# EAGLE design mems_quart_board_exp_4_small (EAGLE 7.6.0)
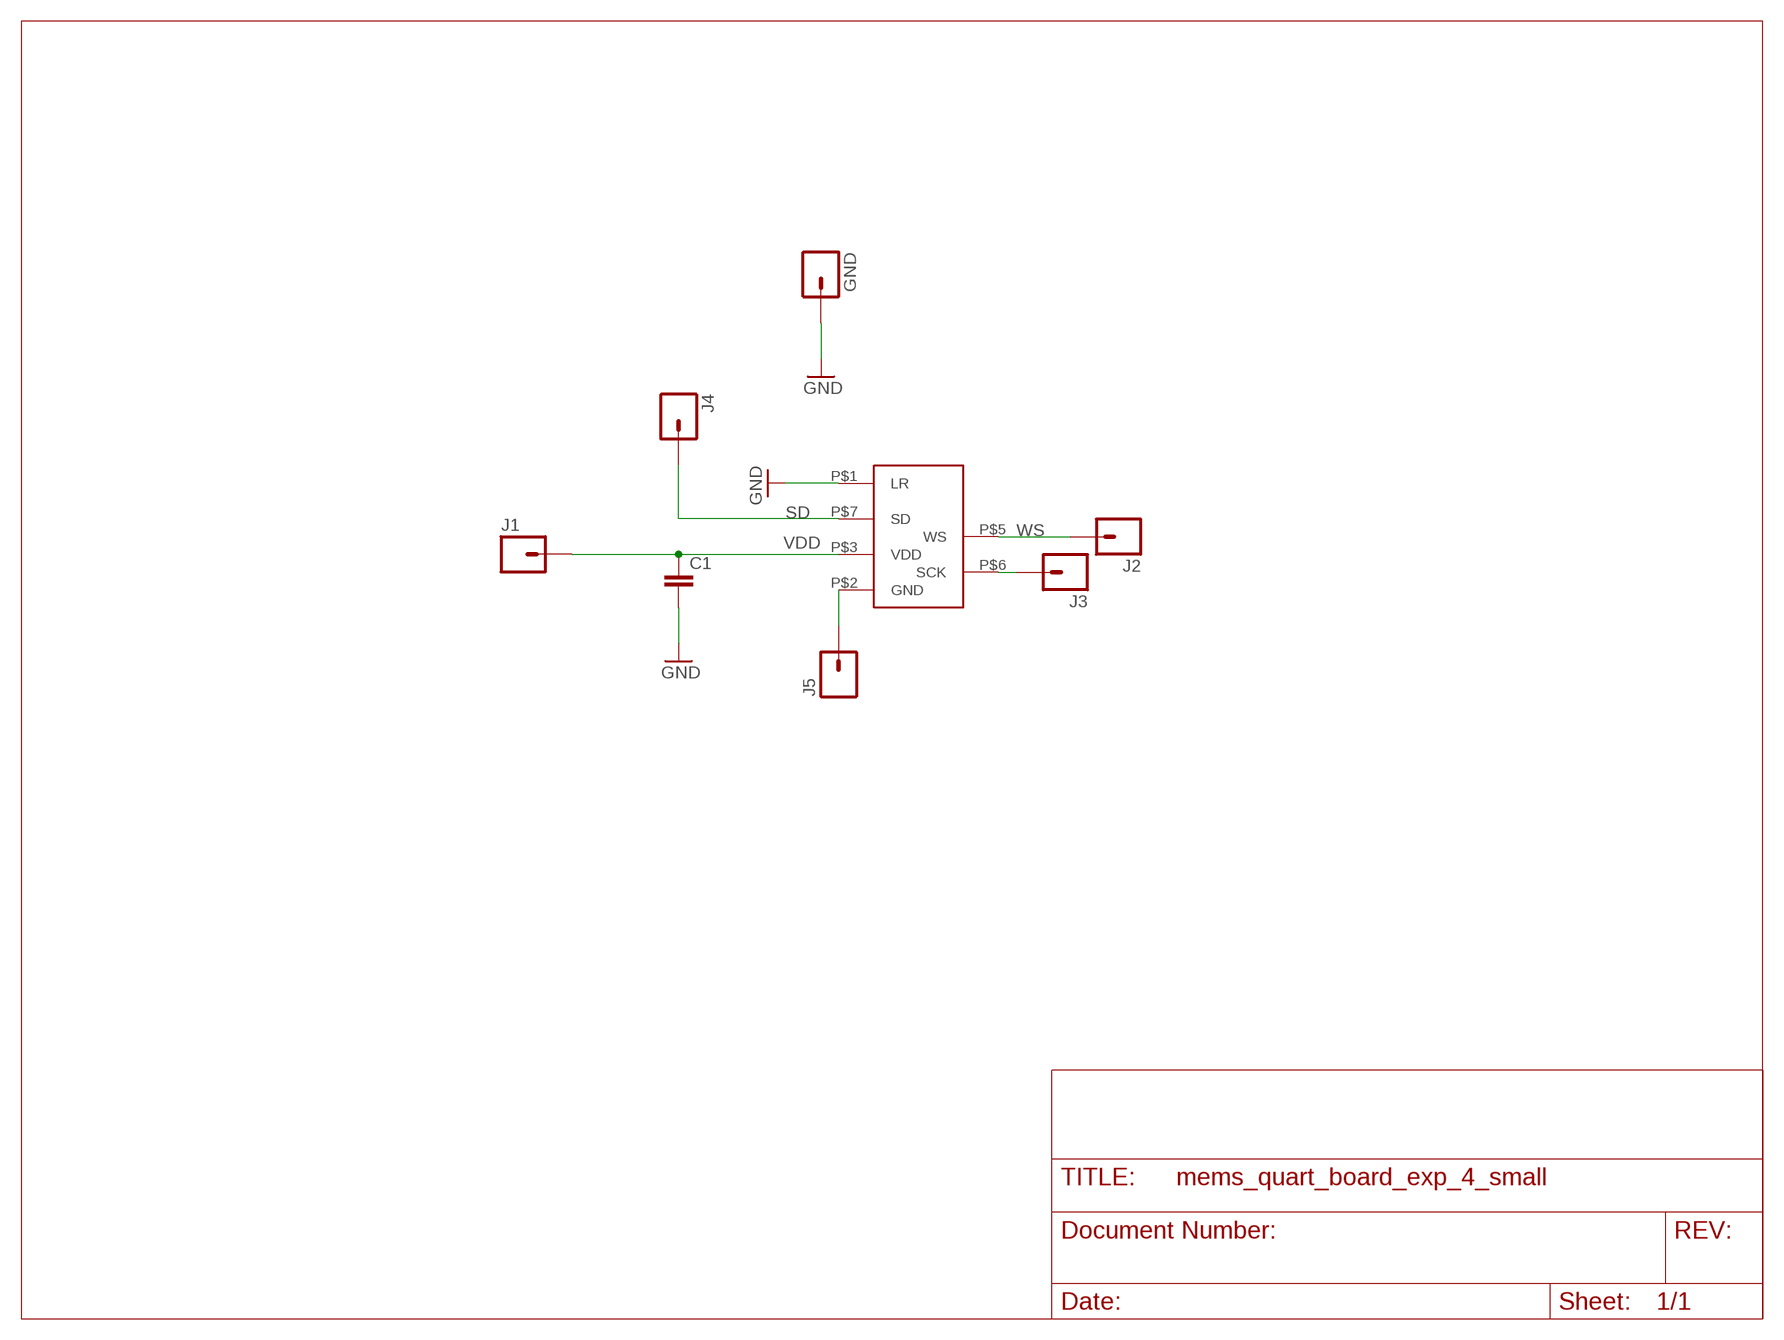
[diagram p0: schematic, sheet 1]

## Parts
C1  0.1UF-16V(+-10%)(0402)  [0402-CAP]
GND  M01PTH_NO_SILK_YES_STOP  [1X01_NO_SILK]
J1  M01NOSILK-KIT  [1X01NS-KIT]
J2  M01NOSILK-KIT  [1X01NS-KIT]
J3  M01NOSILK-KIT  [1X01NS-KIT]
J4  M01NOSILK-KIT  [1X01NS-KIT]
J5  M01NOSILK-KIT  [1X01NS-KIT]
U$1  MEMS_ICS_43432  [MEMS_ICS_43432]

## Nets
GND: C1.2 GND.1 J5.1 U$1.P$1(LR) U$1.P$2(GND)
SCK: J3.1 U$1.P$6(SCK)
SD: J4.1 U$1.P$7(SD)
VDD: C1.1 J1.1 U$1.P$3(VDD)
WS: J2.1 U$1.P$5(WS)

## Library data of the parts
C1 = SparkFun-Capacitors:0.1UF-16V(+-10%)(0402); PROD_ID: CAP-12416; VALUE: 0.1uF
GND = CM-SparkFun-Connectors-2:M01: Header 1 Standard 1-pin 0.1" header. Use with straight break away headers (SKU : PRT-00116), right angle break away headers (PRT-00553), swiss pins (PRT-00743), machine pins (PRT-00117), and female headers (PRT-00115). SMTSO-256-ET is a "flush mount" nut for a 4-40 screw. The older package used to be too tight, and did not allow it to sit properly thru the drill hit. The latest (0.165DIA) fits nice and snug.
J1-J5 = CM-SparkFun-Connectors:M01: Header 1 Standard 1-pin 0.1" header. Use with straight break away headers (SKU : PRT-00116), right angle break away headers (PRT-00553), swiss pins (PRT-00743), machine pins (PRT-00117), and female headers (PRT-00115). SMTSO-256-ET is a "flush mount" nut for a 4-40 screw. The older package used to be too tight, and did not allow it to sit properly thru the drill hit. The latest (0.165DIA) fits nice and snug.
U$1 = mems_ics_43432:MEMS_ICS_43432

## Net classes
0 default: clearance 0.205 mm

## Board
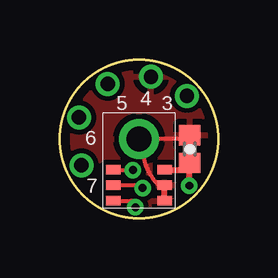
[diagram p1: board, top side]
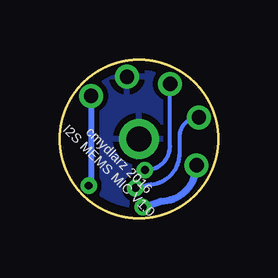
[diagram p2: board, bottom side, seen from below]

Size 6.6 x 6.6 mm. Coordinates in mm from the lower left corner, seen from the top.
Outline: circle at 3.3,3.3 radius 3.3
Copper layers (1*16): Top 0.0356mm / dielectric 1.5011mm / Bottom 0.0356mm
Design rules "oshpark-2layer *": minimum track width 6mil, minimum drill 13mil, track to track 6mil, track to pad 6mil, pad to pad 6mil, via to via 6mil, smd to smd 6mil, copper to edge 15mil, drill to drill 6mil, minimum pad ring 7mil, minimum via ring 7mil, stop-mask expansion 0mil, vias tented up to drill 20mil, thermal gap 10mil

### Footprints (pad centres in the part's own frame; a part is rotated, then mirrored left to right if it is on the bottom)
0402-CAP = smd 0.85 x 0.9: 1 -0.58,0; 2 0.58,0
1X01_NO_SILK = drill 1.05 pad 1.65: 1 0,0
1X01NS-KIT = drill 0.6 pad 1: 1 0,0
MEMS_ICS_43432 = smd 0.6 x 0.4: P$1 2.575,0.325; P$2 2.575,0.975; P$3 2.575,1.615; P$5 0.425,1.625; P$6 0.425,0.975; P$7 0.425,0.325

### Placement (x,y rotation side)
C1  5.42,2.88 90 top
GND  3.3,3.3 0 top
J1  5.3,5.1 0 top
J2  2,5.6 0 top
J3  0.8,4.2 0 top
J4  0.9,2.2 0 top
J5  3.8,5.9 0 top
U$1  1.8,0.4 0 top

### Tracks (layer width: path | path; a pad name or v marks a point on that pad's centre or on a via)
GND
  Top 0.16: C1.2 arc-90 5.26,3.3 GND.1 3.6,2.2 arc26 4.1,1.4 4.12,1.37 U$1.P$2
  Top 0.254: U$1.P$1 U$1.P$2
  pour Top (isolate 0.152): 3.7,6.8 arc-28 4.5,6.6 arc13 5,6.4 arc-40 5.7,5.9 arc8 6.1,5.4 arc-18 6.5,4.8 arc-17 6.7,4.1 arc-4 6.8,3 arc-20 6.7,2.2 arc-19 6.4,1.6 arc-6 6,1.1 arc-7 5.5,0.6 arc-19 4.7,0.1 arc-4 3.9,-0.2 arc-37 2.9,-0.2 arc9 2.1,0 arc-27 1.4,0.3 arc-7 0.7,0.9 arc-27 0.2,1.7 arc7 -0.2,2.7 arc-51 -0.2,3.8 arc7 0.2,4.8 arc-28 0.9,5.9 arc-19 1.8,6.5 arc-25
  pour Bottom: 1.2,6.1 arc-28 1.7,6.4 arc13 2.4,6.7 arc-31 2.8,6.8 arc-7 4,6.7 arc-34 5.5,6 arc-25 6.5,4.6 arc-20 6.8,3.3 arc-27 6.6,2.2 arc-6 6.1,1.2 arc-31 5.3,0.4 arc-10 4.2,-0.1 arc-39 2.5,-0.1 arc-11 1,0.6 arc-29 0.7,0.9 arc-1 0,2.1 arc-43 -0.2,3.5 arc-1 0.1,4.7 arc-45
SCK  (via drill 0.33 pad 0.25)
  Top 0.16: 2.25,1.4 2.25,1.39 3.31,1.39 arc-90 v3.45,1.25
  Top 0.254: U$1.P$6 arc-90 2.25,1.4
  Bottom 0.16: v3.45,1.25 2.9,1.4 arc-90 1.6,2.7 1.6,3.4 arc90 J3.1
SD  (via drill 0.33 pad 0.25)
  Top 0.16: U$1.P$7 2.98,0.72 arc-90 v3.15,0.45
  Bottom 0.3: v3.15,0.45 2.4,0.7 arc-90 J4.1
VDD  (via drill 0.33)
  Top 0.254: U$1.P$3 5.14,2.01 arc90 C1.1 arc90 5.4,2.28 v5.4,1.35
  Bottom 0.254: J1.1 5.3,1.4 arc90 v5.4,1.35
WS  (via drill 0.33 pad 0.25)
  Top 0.16: 2.25,2 v3.05,2
  Top 0.254: U$1.P$5 arc90 2.25,2
  Bottom 0.16: v3.05,2 arc-90 2,3 J2.1

### Text on the board
tNames: 5 | 4 | 3 | 6 | 7
bNames: cmydlarz 2016 / I2S MEMS MIC V1.0